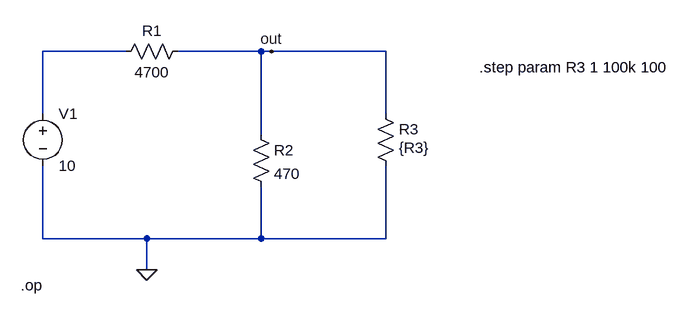
[diagram p0: schematic Draft1.asc]
Draft1.asc, the LTspice schematic file:
Version 4
SHEET 1 1036 680
WIRE 176 32 48 32
WIRE 384 32 256 32
WIRE 400 32 384 32
WIRE 576 32 400 32
WIRE 48 128 48 32
WIRE 576 128 576 32
WIRE 384 160 384 32
WIRE 48 320 48 208
WIRE 208 320 48 320
WIRE 384 320 384 240
WIRE 384 320 208 320
WIRE 576 320 576 208
WIRE 576 320 384 320
WIRE 208 368 208 320
FLAG 208 368 0
FLAG 400 32 out
SYMBOL res 368 144 R0
SYMATTR InstName R2
SYMATTR Value 470
SYMBOL voltage 48 112 R0
WINDOW 123 0 0 Left 0
WINDOW 39 0 0 Left 0
SYMATTR InstName V1
SYMATTR Value 10
SYMBOL res 272 16 R90
WINDOW 0 0 56 VBottom 2
WINDOW 3 32 56 VTop 2
SYMATTR InstName R1
SYMATTR Value 4700
SYMBOL res 560 112 R0
WINDOW 3 36 68 Left 2
SYMATTR InstName R3
SYMATTR Value {R3}
TEXT 720 56 Left 2 !.step param R3 1 100k 100
TEXT 14 392 Left 2 !.op

The netlist it stands for:
* Draft1.asc
R2 out 0 470
V1 N001 0 10
R1 out N001 4700
R3 out 0 {R3}
.step param R3 1 100k 100
.op
.backanno
.end

* Results of the author's LTspice run, read from the files saved beside the schematic
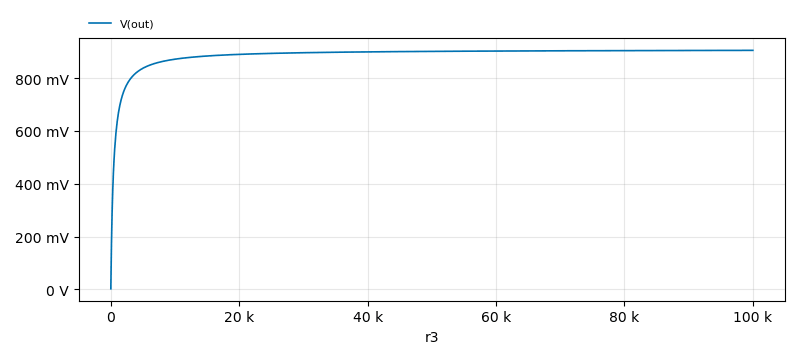
[diagram p1: Operating Point of Draft1.asc, plotted from the saved traces]
* Operating Point, 1 run:
*   V(out): 2.123 mV at r3=1 , 905.2 mV at r3=100 k, min 2.123 mV, max 905.2 mV